# Altium project 3x VCO.PrjPcb
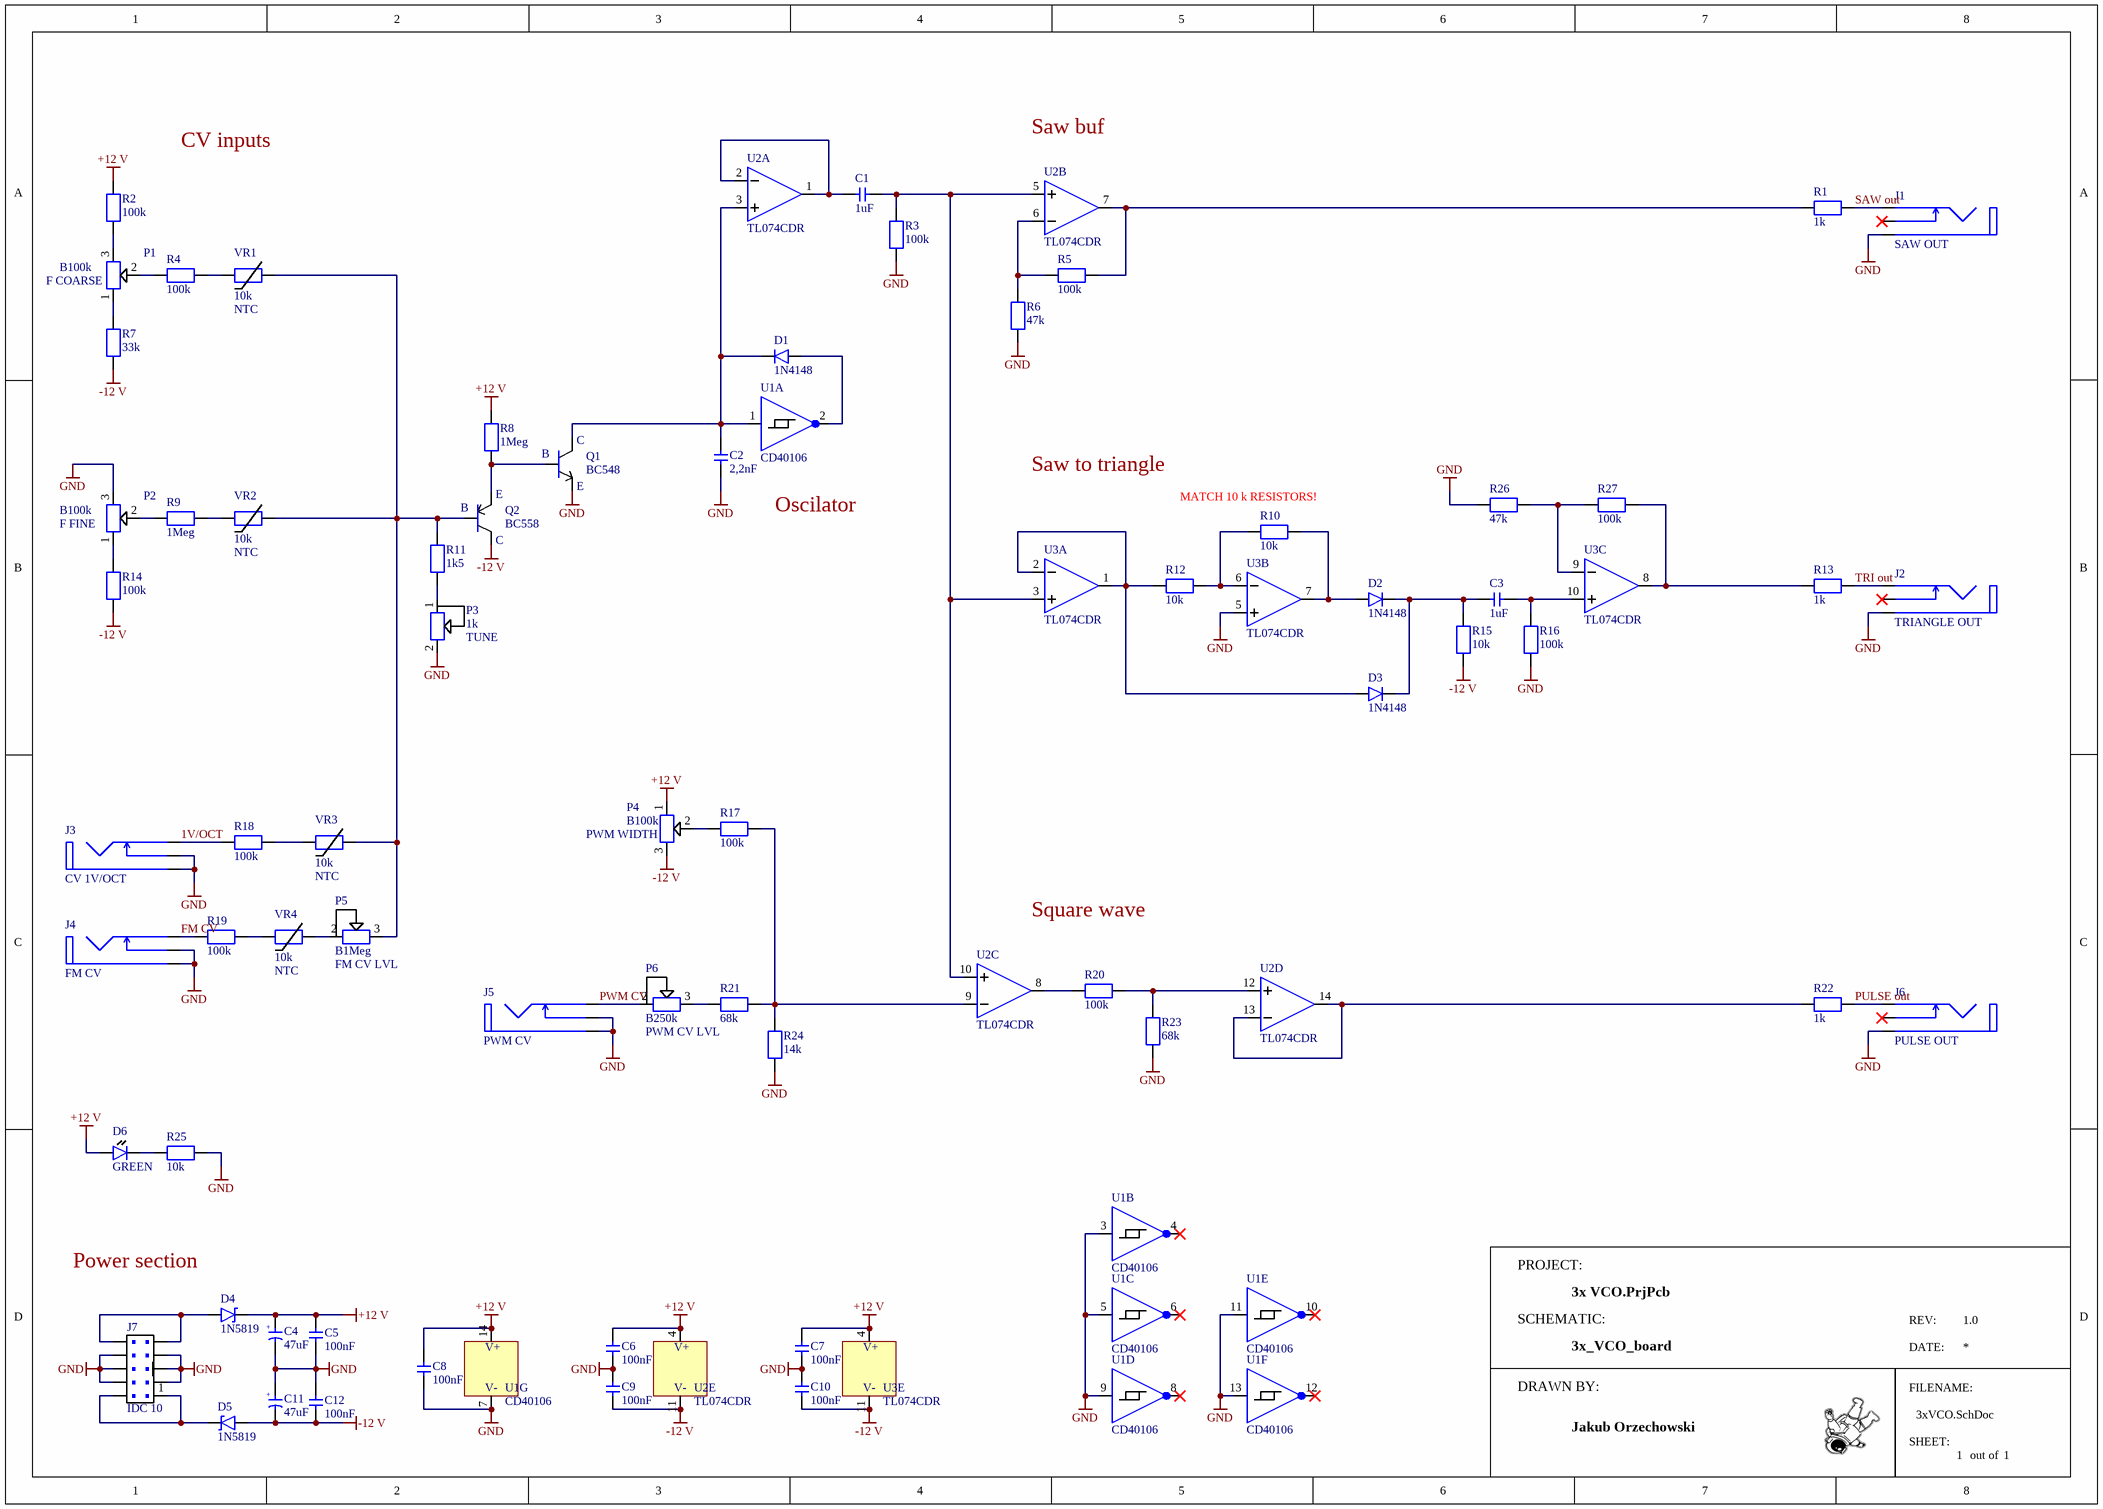
[diagram p0: 3xVCO.SchDoc]
1 sheet, 67 parts. Net scope: global (net labels, ports and power ports of the same name join across sheets).
Board file: 3xVCO.PcbDoc

## Sheet 3xVCO.SchDoc: 3x_VCO_board
size A3; Author: Jakub Orzechowski; Revision: 1.0; SheetNumber: 1; SheetTotal: 1

### Parts
C1  value 1uF  [Cap THT 5mm]  (hidden comment: CAP)
C2  value 2,2nF  [Cap THT 5mm]  (hidden comment: CAP)
C3  value 1uF  [Cap THT 5mm]  (hidden comment: CAP)
C4  value 47uF  [Cap electrolytic THT 5mm]  (hidden comment: CAP)
C5  value 100nF  [Cap THT 5mm]  (hidden comment: CAP)
C6  value 100nF  [Cap THT 5mm]  (hidden comment: CAP)
C7  value 100nF  [Cap THT 5mm]  (hidden comment: CAP)
C8  value 100nF  [Cap THT 5mm]  (hidden comment: CAP)
C9  value 100nF  [Cap THT 5mm]  (hidden comment: CAP)
C10  value 100nF  [Cap THT 5mm]  (hidden comment: CAP)
C11  value 47uF  [Cap electrolytic THT 5mm]  (hidden comment: CAP)
C12  value 100nF  [Cap THT 5mm]  (hidden comment: CAP)
D1  Model: 1N4148  [Diode THT 10 mm]  (hidden comment: DIODE)
D2  Model: 1N4148  [Diode THT 10 mm]  (hidden comment: DIODE)
D3  Model: 1N4148  [Diode THT 10 mm]  (hidden comment: DIODE)
D4  Model: 1N5819  [Diode THT 10 mm]  (hidden comment: SCHOTTKY)
D5  Model: 1N5819  [Diode THT 10 mm]  (hidden comment: SCHOTTKY)
D6  Color: GREEN  [LED SMD 0805]  (hidden comment: LED)
J1  Label: SAW OUT  [PJ301M]  (hidden comment: JACK Mono)
J2  Label: TRIANGLE OUT  [PJ301M]  (hidden comment: JACK Mono)
J3  Label: CV 1V/OCT  [PJ301M]  (hidden comment: JACK Mono)
J4  Label: FM CV  [PJ301M]  (hidden comment: JACK Mono)
J5  Label: PWM CV  [PJ301M]  (hidden comment: JACK Mono)
J6  Label: PULSE OUT  [PJ301M]  (hidden comment: JACK Mono)
J7  IDC 10  [IDC 10 PIN]
P1  value B100k  Parameter: F COARSE  [Alpha 9mm mono]  (hidden comment: Mono Pot)
P2  value B100k  Parameter: F FINE  [9 mm PCB Potentiometer]  (hidden comment: Mono Pot)
P3  value 1k  Parameter: TUNE  [Multiturn Potentiometer inline]  (hidden comment: VR)
P4  value B100k  Parameter: PWM WIDTH  [9 mm PCB Potentiometer]  (hidden comment: Mono Pot)
P5  value B1Meg  Parameter: FM CV LVL  [9 mm PCB Potentiometer]  (hidden comment: VR)
P6  value B250k  Parameter: PWM CV LVL  [9 mm PCB Potentiometer]  (hidden comment: VR)
Q1  BC548  [TO-92 wide]
Q2  BC558  [TO-92 wide]
R1  value 1k  [Resistor THT vertical]  (hidden comment: RES)
R2  value 100k  [Resistor THT vertical]  (hidden comment: RES)
R3  value 100k  [Resistor THT vertical]  (hidden comment: RES)
R4  value 100k  [Resistor THT vertical]  (hidden comment: RES)
R5  value 100k  [Resistor THT vertical]  (hidden comment: RES)
R6  value 47k  [Resistor THT vertical]  (hidden comment: RES)
R7  value 33k  [Resistor THT vertical]  (hidden comment: RES)
R8  value 1Meg  [Resistor THT vertical]  (hidden comment: RES)
R9  value 1Meg  [Resistor THT vertical]  (hidden comment: RES)
R10  value 10k  [Resistor THT vertical]  (hidden comment: RES)
R11  value 1k5  [Resistor THT vertical]  (hidden comment: RES)
R12  value 10k  [Resistor THT vertical]  (hidden comment: RES)
R13  value 1k  [Resistor THT vertical]  (hidden comment: RES)
R14  value 100k  [Resistor THT vertical]  (hidden comment: RES)
R15  value 10k  [Resistor THT vertical]  (hidden comment: RES)
R16  value 100k  [Resistor THT vertical]  (hidden comment: RES)
R17  value 100k  [Resistor THT vertical]  (hidden comment: RES)
R18  value 100k  [Resistor THT vertical]  (hidden comment: RES)
R19  value 100k  [Resistor THT vertical]  (hidden comment: RES)
R20  value 100k  [Resistor THT vertical]  (hidden comment: RES)
R21  value 68k  [Resistor THT vertical]  (hidden comment: RES)
R22  value 1k  [Resistor THT vertical]  (hidden comment: RES)
R23  value 68k  [Resistor THT vertical]  (hidden comment: RES)
R24  value 14k  [Resistor THT vertical]  (hidden comment: RES)
R25  value 10k  [Resistor SMD 0805]  (hidden comment: RES)
R26  value 47k  [Resistor THT vertical]  (hidden comment: RES)
R27  value 100k  [Resistor THT vertical]  (hidden comment: RES)
U1  CD40106  [DIP-14 socket]  (parts A,B,C,D,E,F,G of 7)
U2  TL074CDR  [SOIC14]  (parts A,B,C,D,E of 5)
U3  TL074CDR  [SOIC14]  (parts A,B,C,E of 5)
VR1  NTC  value 10k  [THERMISTOR THT 2,54 MM]
VR2  NTC  value 10k  [THERMISTOR THT 2,54 MM]
VR3  NTC  value 10k  [THERMISTOR THT 2,54 MM]
VR4  NTC  value 10k  [THERMISTOR THT 2,54 MM]

### Nets
+12 V: C4.2 C5.2 C6.2 C7.2 C8.2 D4.2 D6.1 P4.1 R2.2 R8.1 U1.14 U2.4 U3.4
-12 V: C9.1 C10.1 C11.1 C12.1 D5.1 P4.3 Q2.1 R7.1 R14.1 R15.2 U2.11 U3.11
GND: C2.1 C4.1 C5.1 C6.1 C7.1 C8.1 C9.2 C10.2 C11.2 C12.2 J1.1 J2.1 J3.1 J3.2 J4.1 J4.2 J5.1 J5.2 J6.1 J7.3 J7.4 J7.5 J7.6 J7.7 J7.8 P2.3 P3.2 Q1.3 R3.2 R6.2 R16.2 R23.1 R24.1 R25.2 R26.1 U1.3 U1.5 U1.7 U1.9 U1.11 U1.13 U3.5
1V/OCT: J3.3 R18.2
FM CV: J4.3 R19.2
PULSE out: J6.3 R22.2
PWM CV: J5.3 P6.2
SAW out: J1.3 R1.2
TRI out: J2.3 R13.2
NetC1_1: C1.1 R3.1 U2.5 U2.10 U3.3
NetC1_2: C1.2 U2.1 U2.2
NetC2_2: C2.2 D1.2 Q1.1 U1.1 U2.3
NetC3_1: C3.1 R16.1 U3.10
NetC3_2: C3.2 D2.2 D3.2 R15.1
NetD1_1: D1.1 U1.2
NetD2_1: D2.1 R10.2 U3.7
NetD3_1: D3.1 R12.1 U3.1 U3.2
NetD4_1: D4.1 J7.9 J7.10
NetD5_2: D5.2 J7.1 J7.2
NetD6_2: D6.2 R25.1
NetP1_1: P1.1 R7.2
NetP1_2: P1.2 R4.2
NetP1_3: P1.3 R2.1
NetP2_1: P2.1 R14.2
NetP2_2: P2.2 R9.2
NetP3_1: P3.1 R11.2
NetP4_2: P4.2 R17.1
NetP5_2: P5.2 VR4.2
NetP5_3: P5.3 Q2.2 R11.1 VR1.2 VR2.2 VR3.2
NetP6_3: P6.3 R21.1
NetQ1_2: Q1.2 Q2.3 R8.2
NetR1_1: R1.1 R5.2 U2.7
NetR4_1: R4.1 VR1.1
NetR5_1: R5.1 R6.1 U2.6
NetR9_1: R9.1 VR2.1
NetR10_1: R10.1 R12.2 U3.6
NetR13_1: R13.1 R27.2 U3.8
NetR17_2: R17.2 R21.2 R24.2 U2.9
NetR18_1: R18.1 VR3.1
NetR19_1: R19.1 VR4.1
NetR20_1: R20.1 U2.8
NetR20_2: R20.2 R23.2 U2.12
NetR22_1: R22.1 U2.13 U2.14
NetR26_2: R26.2 R27.1 U3.9

Not connected (* = marked no-connect by the designer): J1 2*; J2 2*; J6 2*; U1 4* 6* 8* 10* 12*

### Notes on the sheet
- CV inputs
- Saw buf
- Oscilator
- Saw to triangle
- (near R10) MATCH 10 k RESISTORS!
- Square wave
- (near D4) Power section
- PROJECT:
- SCHEMATIC:
- REV:
- DRAWN BY:
- DATE:
- FILENAME:
- SHEET:
- out of
- (in symbol BC548) C; B; E
- (in symbol BC558) E; B; C
- (in symbol Capacitor Electr THT 5mm) +
- (in symbol CD40106 DIP-14, part G) V+; V-
- (in symbol TL074CDR SOIC14, part E) V+; V-

### Library data of the parts
C1-C3 C5-C10 C12 = Capacitor THT 5mm: THT Capacitor Non-Polarised 5 mm Pitch; Voltage rating: *; Tolerance: *; Package Type: THT
C4 C11 = Capacitor Electr THT 5mm: THT Electrolytic Capacitor 5 mm Diameter; Voltage rating: *; Tolerance: *; Package Type: THT
D1-D3 = Diode THT: Generic THT Axial Diode 10 mm Pitch; Max reverse voltage: *; Max current: *; Forward voltage: *; Package Type: THT; Type: Diode
D4 D5 = Schottky Diode THT: Generic THT Axial Schottky Diode 10 mm Pitch; Max Reverse Voltage: *; Max Current: *; Package Type: THT; Type: Schottky
D6 = LED SMD: SMD LED Diode 0805 Package; Forward voltage: *; Package Type: SMD; Type: LED
J1-J6 = PJ301M: PJ301M Eurorack 3,5 mm Patch Socket PCB Mount; Package Type: THT
J7 = IDC 10 pin: 10 Pin IDC Connector
P1 = Potentiometer Alpha 9mm mono: PCB Mount Alpha 9mm Mono Potentiometer THT; Taper: *; Package Type: THT; Type: Potentiometer
P2 P4 = Potentiometer 9 mm: PCB Mount 9mm Mono Potentiometer THT; Taper: *; Package Type: THT; Type: Potentiometer
P3 = VR A Multiturn THT: PCB Mount Multiturn Trimmer Potentiometer Top Adjustable as Variable Resistor Clockwise Increase; Taper: *; Package Type: THT; Type: Potentiometer
P5 P6 = VR B 9 mm: PCB Mount 9mm Mono Potentiometer THT as Variable Resistor Clockwise Decrease; Taper: *; Package Type: THT; Type: Potentiometer
Q1 = BC548: BC548 NPN Transistor THT TO-92 Package; Package Type: THT; Type: NPN Transistor; Package: TO-92; Group: *
Q2 = BC558: BC558 PNP Transistor THT TO-92 Package; Package Type: THT; Type: PNP Transistor; Package: TO-92; Group: *
R1-R24 R26 R27 = Resistor THT: THT Axial Resistor 10mm Pitch; Tolerance: *; Package Type: THT
R25 = Resistor SMD 0805: SMD Resistor 0805 package; Tolerance: *; Package Type: SMD
U1 = CD40106 DIP-14: CD40106 Hex Schmitt Trigger Inverter DIP-14 Package; Type: Schmitt Trigger; Package Type: THT; Package: DIP-14
U2 U3 = TL074CDR SOIC14: TL074CDR Quad Op-Amp SOIC14 Package; Type: Op Amp; Package Type: SMD; Package: SOIC14
VR1-VR4 = Thermistor NTC THT: THT NTC Thermistor 2,54 mm Pitch; Tolerance: *; Package Type: THT